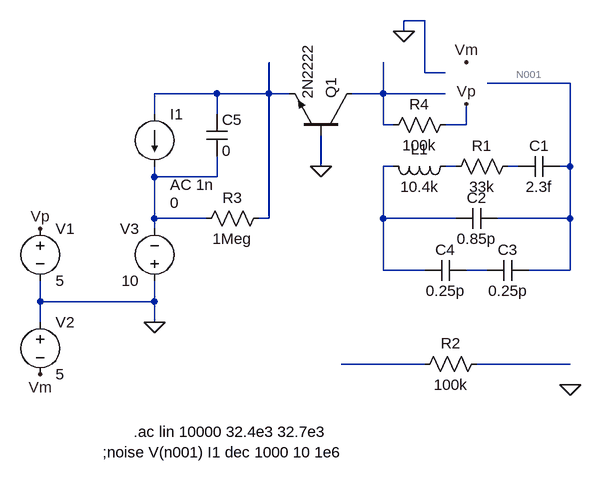
[diagram p0: schematic xtal_filt.asc]
xtal_filt.asc, the LTspice schematic file:
Version 4
SHEET 1 880 696
WIRE 272 16 240 16
WIRE 240 32 240 16
WIRE 272 96 272 16
WIRE 304 96 272 96
WIRE 496 112 368 112
WIRE -48 128 -144 128
WIRE 32 128 32 80
WIRE 32 128 -48 128
WIRE 64 128 32 128
WIRE 208 128 208 80
WIRE 208 128 160 128
WIRE 304 128 208 128
WIRE -144 160 -144 128
WIRE -48 160 -48 128
WIRE 208 176 208 128
WIRE 224 176 208 176
WIRE 336 176 336 144
WIRE 336 176 304 176
WIRE 112 240 112 192
WIRE 224 240 208 240
WIRE 320 240 304 240
WIRE 416 240 400 240
WIRE 496 240 496 112
WIRE 496 240 480 240
WIRE -144 256 -144 240
WIRE -48 256 -48 224
WIRE -48 256 -144 256
WIRE -144 320 -144 256
WIRE -64 320 -144 320
WIRE 32 320 32 128
WIRE 32 320 16 320
WIRE 208 320 208 240
WIRE 320 320 208 320
WIRE 496 320 496 240
WIRE 496 320 384 320
WIRE -144 336 -144 320
WIRE 208 400 208 320
WIRE 272 400 208 400
WIRE 368 400 336 400
WIRE 496 400 496 320
WIRE 496 400 432 400
WIRE -320 448 -320 416
WIRE -144 448 -144 416
WIRE -144 448 -320 448
WIRE -320 480 -320 448
WIRE -144 480 -144 448
WIRE 272 544 144 544
WIRE 496 544 352 544
FLAG 336 144 Vp
FLAG 336 80 Vm
FLAG -320 560 Vm
FLAG -320 336 Vp
FLAG 496 576 0
FLAG 112 240 0
FLAG -144 480 0
FLAG 240 32 0
SYMBOL cap 480 224 R90
WINDOW 0 0 32 VBottom 2
WINDOW 3 32 32 VTop 2
SYMATTR InstName C1
SYMATTR Value 2.3f
SYMBOL cap 384 304 R90
WINDOW 0 0 32 VBottom 2
WINDOW 3 32 32 VTop 2
SYMATTR InstName C2
SYMATTR Value 0.85p
SYMBOL cap 432 384 R90
WINDOW 0 0 32 VBottom 2
WINDOW 3 32 32 VTop 2
SYMATTR InstName C3
SYMATTR Value 0.25p
SYMBOL cap 336 384 R90
WINDOW 0 0 32 VBottom 2
WINDOW 3 32 32 VTop 2
SYMATTR InstName C4
SYMATTR Value 0.25p
SYMBOL res 416 224 R90
WINDOW 0 0 56 VBottom 2
WINDOW 3 32 56 VTop 2
SYMATTR InstName R1
SYMATTR Value 33k
SYMBOL ind 320 224 R90
WINDOW 0 5 56 VBottom 2
WINDOW 3 32 56 VTop 2
SYMATTR InstName L1
SYMATTR Value 10.4k
SYMBOL current -144 160 R0
WINDOW 3 24 136 Left 2
WINDOW 123 24 108 Left 2
WINDOW 39 0 0 Left 0
SYMATTR Value 0
SYMATTR Value2 AC 1n
SYMATTR InstName I1
SYMBOL cap -64 160 R0
SYMATTR InstName C5
SYMATTR Value 0
SYMBOL voltage -320 320 R0
WINDOW 123 0 0 Left 0
WINDOW 39 0 0 Left 0
SYMATTR InstName V1
SYMATTR Value 5
SYMBOL voltage -320 464 R0
WINDOW 123 0 0 Left 0
WINDOW 39 0 0 Left 0
SYMATTR InstName V2
SYMATTR Value 5
SYMBOL res 368 528 R90
WINDOW 0 0 56 VBottom 2
WINDOW 3 32 56 VTop 2
SYMATTR InstName R2
SYMATTR Value 100k
SYMBOL npn 160 192 M270
SYMATTR InstName Q1
SYMATTR Value 2N2222
SYMBOL voltage -144 432 R180
WINDOW 0 24 96 Left 2
WINDOW 3 24 16 Left 2
WINDOW 123 0 0 Left 0
WINDOW 39 0 0 Left 0
SYMATTR InstName V3
SYMATTR Value 10
SYMBOL res 32 304 R90
WINDOW 0 0 56 VBottom 2
WINDOW 3 32 56 VTop 2
SYMATTR InstName R3
SYMATTR Value 1Meg
SYMBOL res 320 160 R90
WINDOW 0 0 56 VBottom 2
WINDOW 3 32 56 VTop 2
SYMATTR InstName R4
SYMATTR Value 100k
TEXT -176 648 Left 2 !.ac lin 10000 32.4e3 32.7e3
TEXT -224 680 Left 2 !;noise V(n001) I1 dec 1000 10 1e6

The netlist it stands for:
* xtal_filt.asc
C1 N001 N006 2.3f
C2 N001 N004 0.85p
C3 N001 N008 0.25p
C4 N008 N004 0.25p
R1 N006 N005 33k
L1 N005 N004 10.4k
I1 N002 N007 0 AC 1n
C5 N002 N007 0
V1 Vp 0 5
V2 0 Vm 5
R2 N010 N009 100k
Q1 N003 0 N002 0 2N2222
V3 0 N007 10
R3 N002 N007 1Meg
R4 Vp N003 100k
.model NPN NPN
.model PNP PNP
.lib standard.bjt
.ac lin 10000 32.4e3 32.7e3
;noise V(n001) I1 dec 1000 10 1e6
.backanno
.end